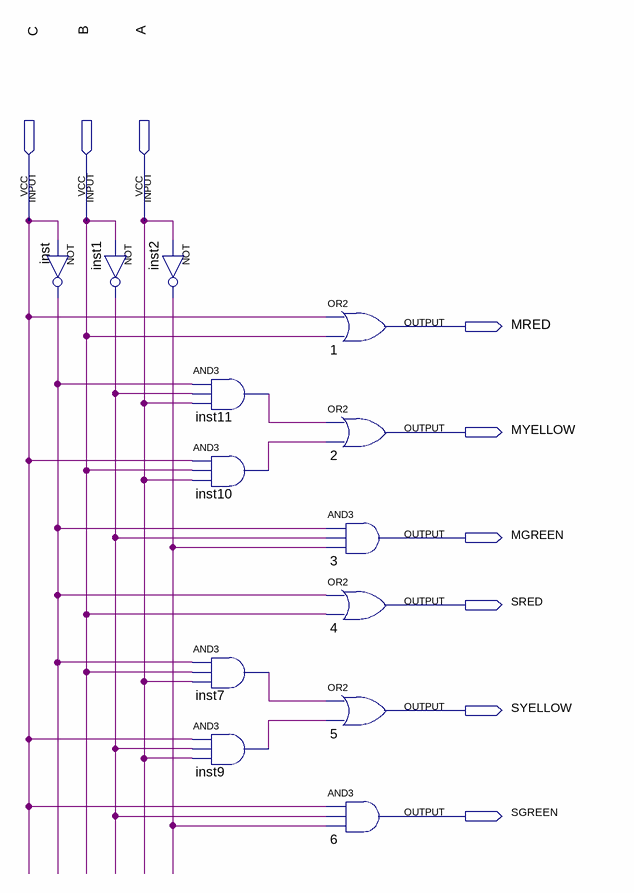
[diagram p0: schematic sheet]
// Quartus schematic TrafficDecoder.bdf as structural Verilog: 13 symbols, 9 pins
module TrafficDecoder (
  input  C,
  input  B,
  input  A,
  output MRED,
  output MYELLOW,
  output MGREEN,
  output SRED,
  output SYELLOW,
  output SGREEN
);

  wire inst1_out, inst2_out, inst7_out, inst9_out, inst10_out, inst11_out, inst_out;

  not inst (inst_out, C);
  not inst1 (inst1_out, B);
  not inst2 (inst2_out, A);
  and inst11 (inst11_out, inst_out, inst1_out, A);
  and inst10 (inst10_out, C, B, A);
  and inst7 (inst7_out, inst_out, B, A);
  and inst9 (inst9_out, C, inst1_out, A);
  or u_1 (MRED, C, B);
  or u_2 (MYELLOW, inst11_out, inst10_out);
  and u_3 (MGREEN, inst_out, inst1_out, inst2_out);
  or u_4 (SRED, inst_out, B);
  or u_5 (SYELLOW, inst7_out, inst9_out);
  and u_6 (SGREEN, C, inst1_out, inst2_out);
endmodule
